# Altium schematic sheet MB1-USB-r1.0.SchDoc: USB2Com & USB Native
size A; DrawnBy: MBoard team; DocumentNumber: 3; Revision: 1.1; SheetNumber: 3; SheetTotal: 7
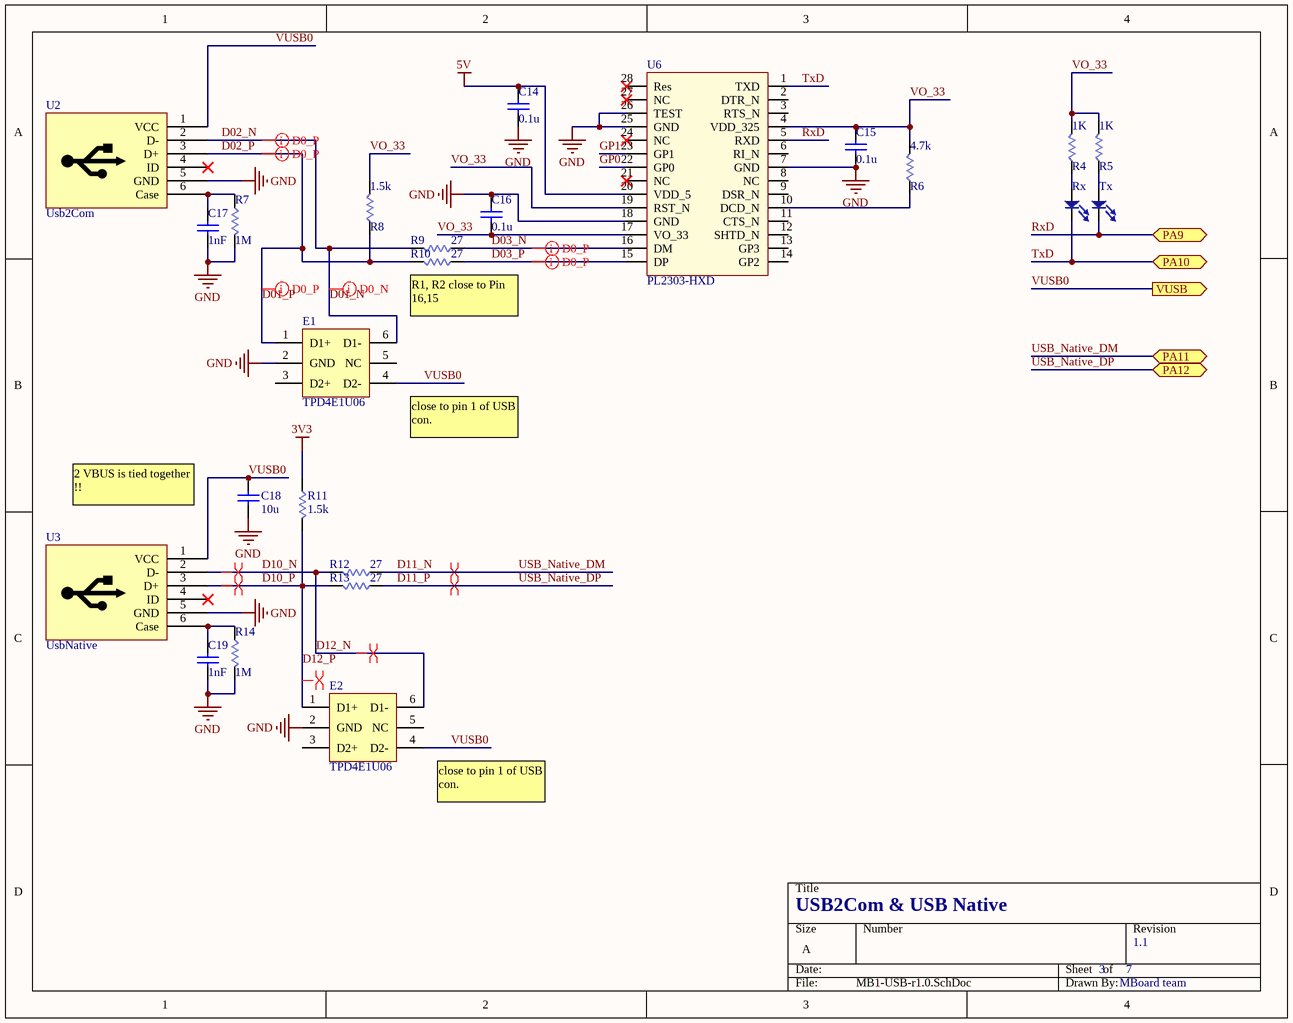
[diagram p0: MB1-USB-r1.0.SchDoc]

## Parts
C14  value 0.1u  [SM_0805_C_CERAMIC]  (hidden comment: CAP Ceramic)
C15  value 0.1u  [SM_0805_C_CERAMIC]  (hidden comment: CAP Ceramic)
C16  value 0.1u  [SM_0805_C_CERAMIC]  (hidden comment: CAP Ceramic)
C17  value 1nF  [SM_0805_C_CERAMIC]  (hidden comment: CAP Ceramic)
C18  value 10u  [SM_0805_C_CERAMIC]  (hidden comment: CAP Ceramic)
C19  value 1nF  [SM_0805_C_CERAMIC]  (hidden comment: CAP Ceramic)
E1  TPD4E1U06  [SC70-6]
E2  TPD4E1U06  [SC70-6]
R4  value 1K  [SM_0805_R]
R5  value 1K  [SM_0805_R]
R6  value 4.7k  [SM_0805_R]
R7  value 1M  [SM_0805_R]
R8  value 1.5k  [SM_0805_R]
R9  value 27  [SM_0805_R]
R10  value 27  [SM_0805_R]
R11  value 1.5k  [SM_0805_R]
R12  value 27  [SM_0805_R]
R13  value 27  [SM_0805_R]
R14  value 1M  [SM_0805_R]
Rx  Blue  [SM_0805_POL_LD]  (value not drawn)
Tx  Green  [SM_0805_POL_LD]  (value not drawn)
U2  Usb2Com  [USB_Micro_typeB_2]
U3  UsbNative  [USB_Micro_typeB_2]
U6  PL2303-HXD  [SSOP-28]

## Ports
PA9 (bidir), PA10 (bidir), PA11 (bidir), PA12 (bidir), VUSB (out)

## Nets
3V3: R11.1
5V: C14.2 U6.20(VDD_5)
GND: C14.1 C15.1 C16.2 C17.1 C18.1 C19.1 E1.2(GND) E2.2(GND) R7.2 R14.2 U2.5(GND) U3.5(GND) U6.7(GND) U6.18(GND) U6.25(GND) U6.26(TEST)
D01_N: E1.6(D1-) R9.2 U2.2(D-)  [also labelled D02_N]
D01_P: E1.1(D1+) R8.1 R10.2 U2.3(D+)  [also labelled D02_P]
D03_N: R9.1 U6.16(DM)
D03_P: R10.1 U6.15(DP)
D10_N: E2.6(D1-) R12.2 U3.2(D-)  [also labelled D12_N]
D10_P: E2.1(D1+) R11.2 R13.2 U3.3(D+)  [also labelled D12_P]
D11_N: R12.1 ; port PA11  [also labelled USB_Native_DM]
D11_P: R13.1 ; port PA12  [also labelled USB_Native_DP]
GP0: U6.22(GP0)
GP1: U6.23(GP1)
RxD: Tx.2(K) U6.5(RXD) ; port PA9
TxD: Rx.2(K) U6.1(TXD) ; port PA10
VO_33: C15.2 C16.1 R4.2 R5.2 R6.2 R8.2 U6.4(VDD_325) U6.17(VO_33) U6.19(RST_N)
VUSB0: C18.2 E1.4(D2-) E2.4(D2-) U2.1(VCC) U3.1(VCC) ; port VUSB
NetC17_2: C17.2 R7.1 U2.6(Case)
NetC19_2: C19.2 R14.1 U3.6(Case)
NetR4_1: R4.1 Rx.1(A)
NetR5_1: R5.1 Tx.1(A)
NetR6_1: R6.1 U6.10(DCD_N)

Not connected (* = marked no-connect by the designer): E1 3(D2+) 5(NC); E2 3(D2+) 5(NC); U2 4(ID)*; U3 4(ID)*; U6 2(DTR_N) 3(RTS_N) 6(RI_N) 8(NC) 9(DSR_N) 11(CTS_N) 12(SHTD_N) 13(GP3) 14(GP2) 21(NC)* 24(NC)* 27(NC)* 28(Res)*

## Layout directives
differential pair: D01_N, D01_P, D03_N, D03_P, D10_N, D10_P, D11_N, D11_P

## Notes on the sheet
- (near R10) R1, R2 close to Pin 16,15
- (near E1) close to pin 1 of USB con.
- 2 VBUS is tied together !!
- (near E2) close to pin 1 of USB con.

## Library data of the parts
C14-C19 = CAP Ceramic: Non-polarity ceramic capacitor; Published: 8-Jun-2000; LatestRevisionDate: 17-Jul-2002; LatestRevisionNote: Re-released for DXP Platform.; PackageReference: RAD-0.3; Publisher: Altium Limited; PackageDescription: Radial Cap, Thru-Hole; 2 Leads; 0.3 in Pin Spacing
R4-R14 = R: Resistor; Published: 8-Jun-2000; LatestRevisionDate: 29-May-2009; LatestRevisionNote: IPC-7351 Footprint Added.; PackageReference: J1-0603; Publisher: Altium Limited; PackageDescription: Chip Resistor
Rx Tx = LED: Published: 8-Jun-2000; LatestRevisionDate: 08-Jul-2005; LatestRevisionNote: Mech Layer 1 removed.; PackageReference: LED-1; Publisher: Altium Limited; PackageDescription: LED; 2 Leads
U2 U3 = USB-Mini-B